# EAGLE design 11A-10 (EAGLE 6.3)
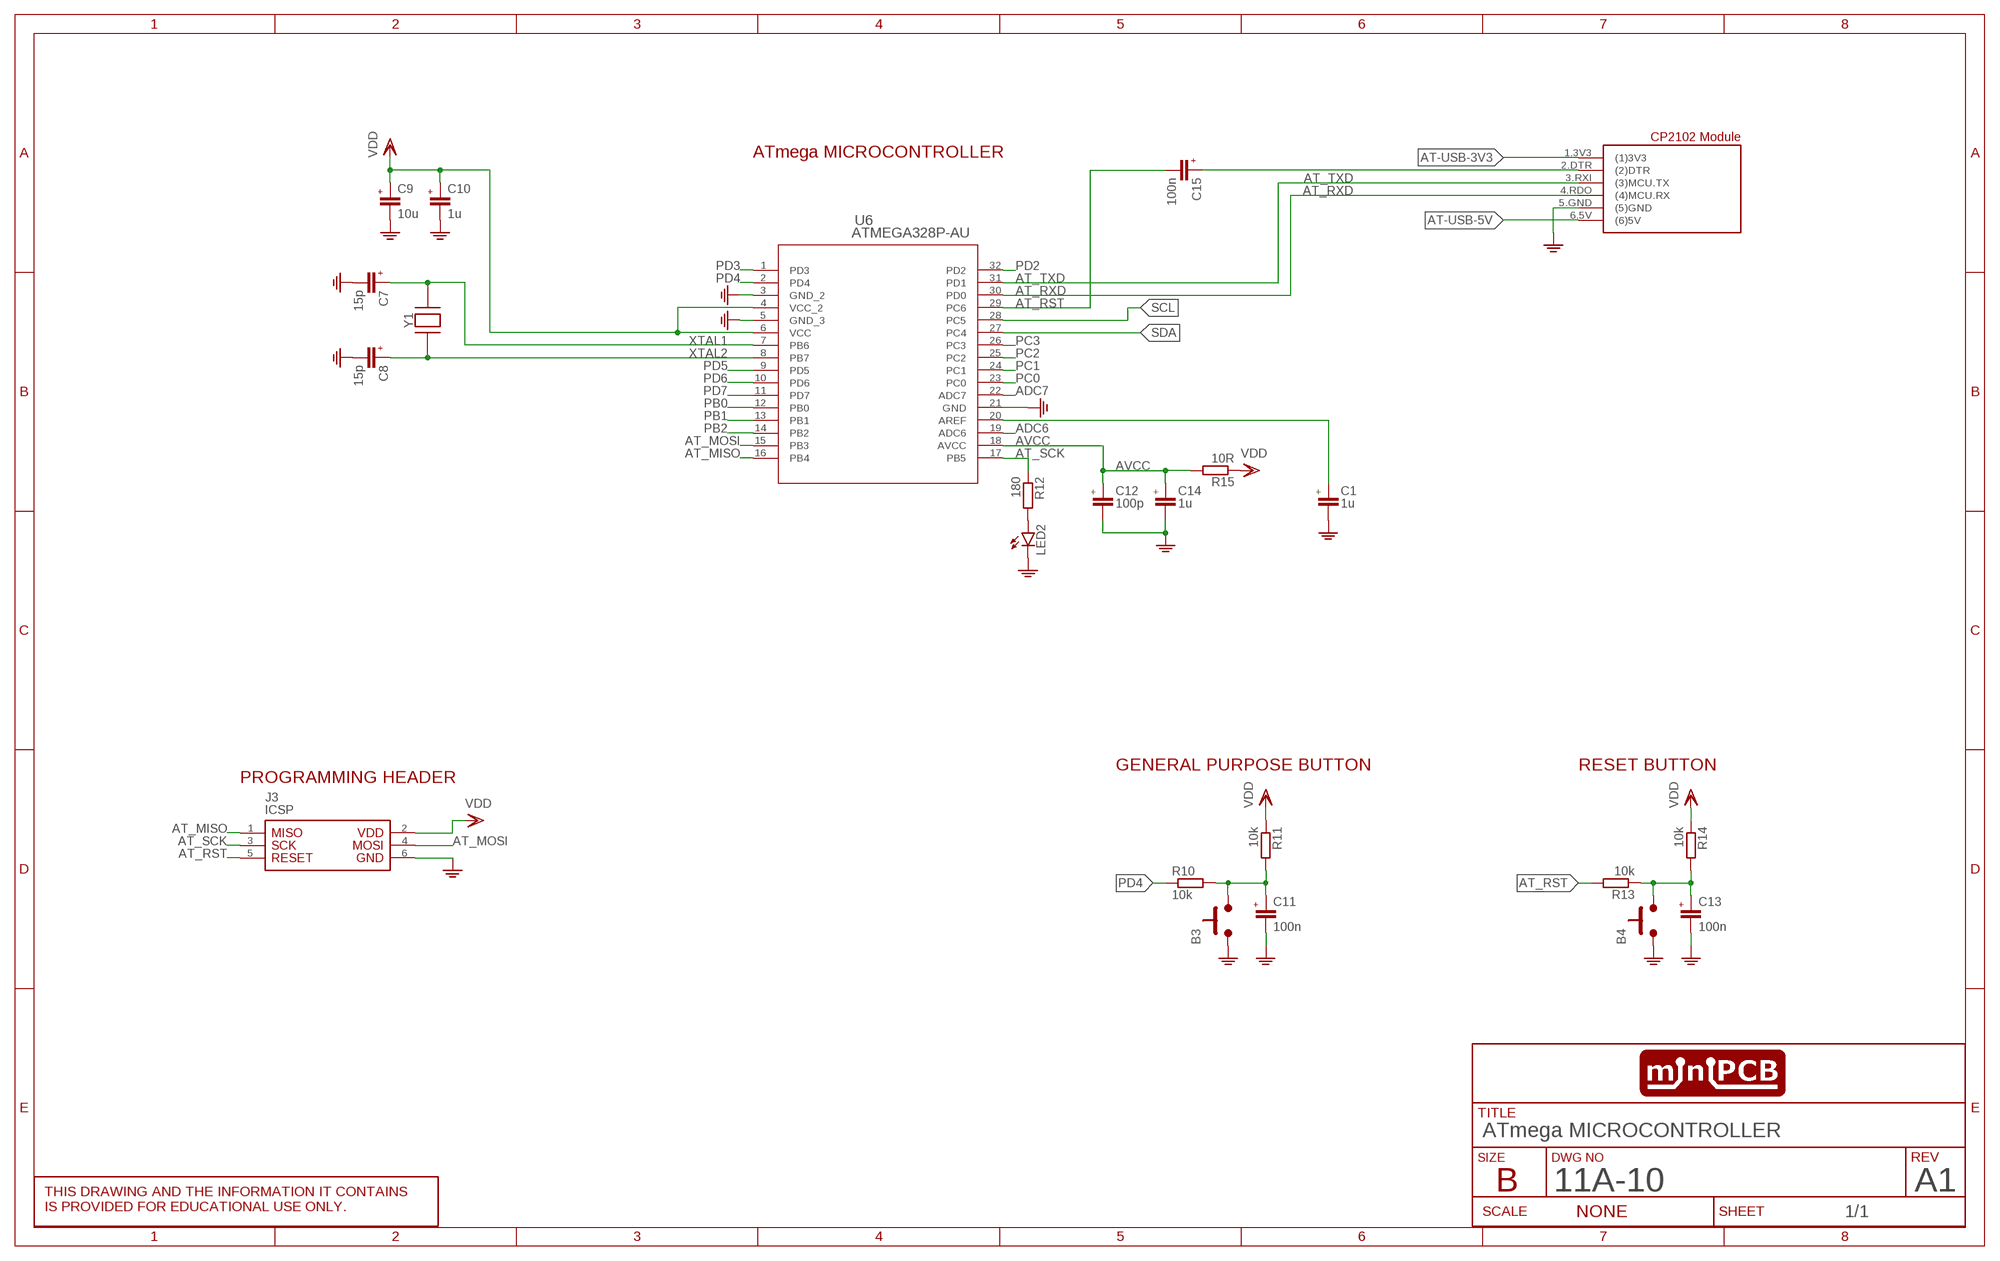
[diagram p0: schematic, sheet 1]
SHEET4 (SCHEMATIC): CIRCUIT_CATEGORY: COMPUTING; CIRCUIT_NAME: MICROCONTROLLER BOARD; CIRCUIT_VARIANT: PIC16F1829, ATmega328P-AU; DR: N. MANTEUFEL; DR_DATE: 31JUL2023; ENG: P. MORTON; ENG_DATE: 31JUL2023; PCB_PCBA: PRINTED CIRCUIT BOARD; REVA: A; REVISION: A1; TITLE: ATmega MICROCONTROLLER

## Parts
B3  PUSHBUTTON6X6MM  [6X6MM]
B4  PUSHBUTTON6X6MM  [6X6MM]
C1  1u  C-EU_C0805  [C0805]
C7  15p  C0603  [C0603]
C8  15p  C0603  [C0603]
C9  10u  C0805  [C0805]
C10  1u  C0805  [C0805]
C11  100n  C0805  [C0805]
C12  100p  C-EU_C0805  [C0805]
C13  100n  C0805  [C0805]
C14  1u  C-EU_C0805  [C0805]
C15  100n  C0805  [C0805]
J3  ICSP  PINS_6-2X3_AT  [PINS_6-2X3_AT]
LED2  LEDSML0805  [SML0805]
R10  10k  R-EU__R0805  [R0805]
R11  10k  R-EU__R0805  [R0805]
R12  180  R-EU__R0805  [R0805]
R13  10k  R-EU__R0805  [R0805]
R14  10k  R-EU__R0805  [R0805]
R15  10R  R-EU__R0805  [R0805]
U6  ATMEGA328P-AU  ATMEGA328-AU  [32A_ATM]
U7  VIVA_USB-TTL  [VIVA_USB_TTL_SUBTEXT]
Y1  CRYSTAL-3225_4P  [TXC7M2]

## Nets
ADC6: U6.19(ADC6)
ADC7: U6.22(ADC7)
AT-USB-3V3: U7.1.3V3((1)3V3)
AT-USB-5V: U7.6.5V((6)5V)
AT_DTR_CAP: C15.1(+) U7.2.DTR((2)DTR)
AT_MISO: J3.1 U6.16(PB4)
AT_MOSI: J3.4 U6.15(PB3)
AT_RST: C15.2(-) J3.5 R13.2 U6.29(PC6)
AT_RST_CAP: B4.3.B B4.4.B C13.1(+) R13.1 R14.2
AT_RXD: U6.30(PD0) U7.4.RDO((4)MCU.RX)
AT_SCK: J3.3 R12.1 U6.17(PB5)
AT_TXD: U6.31(PD1) U7.3.RXI((3)MCU.TX)
AVCC: C12.1 C14.1 R15.2 U6.18(AVCC)
GND: B3.1.A B3.2.A B4.1.A B4.2.A C1.2 C7.1(-) C8.1(-) C9.2(-) C10.2(-) C11.2(-) C12.2 C13.2(-) C14.2 J3.6 LED2.C U6.3(GND_2) U6.5(GND_3) U6.21(GND) U7.5.GND((5)GND)
N$4: C1.1 U6.20(AREF)
N$37: LED2.A R12.2
PB0: U6.12(PB0)
PB1: U6.13(PB1)
PB2: U6.14(PB2)
PC0: U6.23(PC0)
PC1: U6.24(PC1)
PC2: U6.25(PC2)
PC3: U6.26(PC3)
PD2: U6.32(PD2)
PD3: U6.1(PD3)
PD4: R10.1 U6.2(PD4)
PD4-CAP: B3.3.B B3.4.B C11.1(+) R10.2 R11.2
PD5: U6.9(PD5)
PD6: U6.10(PD6)
PD7: U6.11(PD7)
SCL: U6.28(PC5)
SDA: U6.27(PC4)
VDD: C9.1(+) C10.1(+) J3.2 R11.1 R14.1 R15.1 U6.4(VCC_2) U6.6(VCC)
XTAL1: C7.2(+) U6.7(PB6) Y1.3
XTAL2: C8.2(+) U6.8(PB7) Y1.1

## Notes on the sheet
- ATmega MICROCONTROLLER
- GENERAL PURPOSE BUTTON | RESET BUTTON
- PROGRAMMING HEADER

## Library data of the parts
B3 B4 = nolan-utsa:PUSHBUTTON: Tactile push button switch
C1 C12 C14 = utsa:C-EU: CAPACITOR, European symbol
C7-C11 C13 C15 = utsa:C
J3 = utsa:PINS_6-2X3_AT; P1: MISO; P2: VDD; P3: SCK; P4: MOSI; P5: RESET; P6: GND
LED2 = utsa:LED: LED OSRAM: - CHIPLED LG R971, LG N971, LY N971, LG Q971, LY Q971, LO R971, LY R971 LH N974, LH R974 LS Q976, LO Q976, LY Q976 LO Q996 - Hyper CHIPLED LW Q18S LB Q993, LB Q99A, LB R99A - SideLED LS A670, LO A670, LY A670, LG A670, LP A670 LB A673, LV A673, LT A673, LW A673 LH A674 LY A675 LS A676, LA A676, LO A676, LY A676, LW A676 LS A679, LY A679, LG A679 - Hyper Micro SIDELED® LS Y876, LA Y876, LO Y876, LY Y876 LT Y87S - SmartLED LW L88C, LW L88S LB L89C, LB L89S, LG L890 LS L89K, LO L89K, LY L89K LS L896, LA L896, LO L896, LY L896 - TOPLED LS T670, LO T670, LY T670, LG T670, LP T670 LSG T670, LSP T670, LSY T670, LOP T670, LYG T670 LG T671, LOG T671, LSG T671 LB T673, LV T673, LT T673, LW T673 LH T674 LS T676, LA T676, LO T676, LY T676, LB T676, LH T676, LSB T676, LW T676 LB T67C, LV T67C, LT T67C, LS T67K, LO T67K, LY T67K, LW E67C LS E67B, LA E67B, LO E67B, LY E67B, LB E67C, LV E67C, LT E67C LW T67C LS T679, LY T679, LG T679 LS T770, LO T770, LY T770, LG T770, LP T770 LB T773, LV T773, LT T773, LW T773 LH T774 LS E675, LA E675, LY E675, LS T675 LS T776, LA T776, LO T776, LY T776, LB T776 LHGB T686 LT T68C, LB T68C - Hyper Mini TOPLED® LB M676 - Mini TOPLED Santana® LG M470 LS M47K, LO M47K, LY M47K Source: http://www.osram.convergy.de LUXEON: - LUMILED® LXK2-PW12-R00, LXK2-PW12-S00, LXK2-PW14-U00, LXK2-PW14-V00 LXK2-PM12-R00, LXK2-PM12-S00, LXK2-PM14-U00 LXK2-PE12-Q00, LXK2-PE12-R00, LXK2-PE12-S00, LXK2-PE14-T00, LXK2-PE14-U00 LXK2-PB12-K00, LXK2-PB12-L00, LXK2-PB12-M00, LXK2-PB14-N00, LXK2-PB14-P00, LXK2-PB14-Q00 LXK2-PR12-L00, LXK2-PR12-M00, LXK2-PR14-Q00, LXK2-PR14-R00 LXK2-PD12-Q00, LXK2-PD12-R00, LXK2-PD12-S00 LXK2-PH12-R00, LXK2-PH12-S00 LXK2-PL12-P00, LXK2-PL12-Q00, LXK2-PL12-R00 Source: www.luxeon.com KINGBRIGHT: KA-3528ASYC Source: www.kingbright.com
R10-R15 = utsa:R-EU_: RESISTOR, European symbol
U6 = utsa:ATMEGA328-AU; COPYRIGHT: Copyright (C) 2021 Ultra Librarian. All rights reserved.; MANUFACTURER_PART_NUMBER: ATMEGA328-AU; MFR_NAME: Microchip
U7 = utsa:VIVA_USB-TTL
Y1 = utsa:CRYSTAL: HC49S Crystal Oscillator

## Board
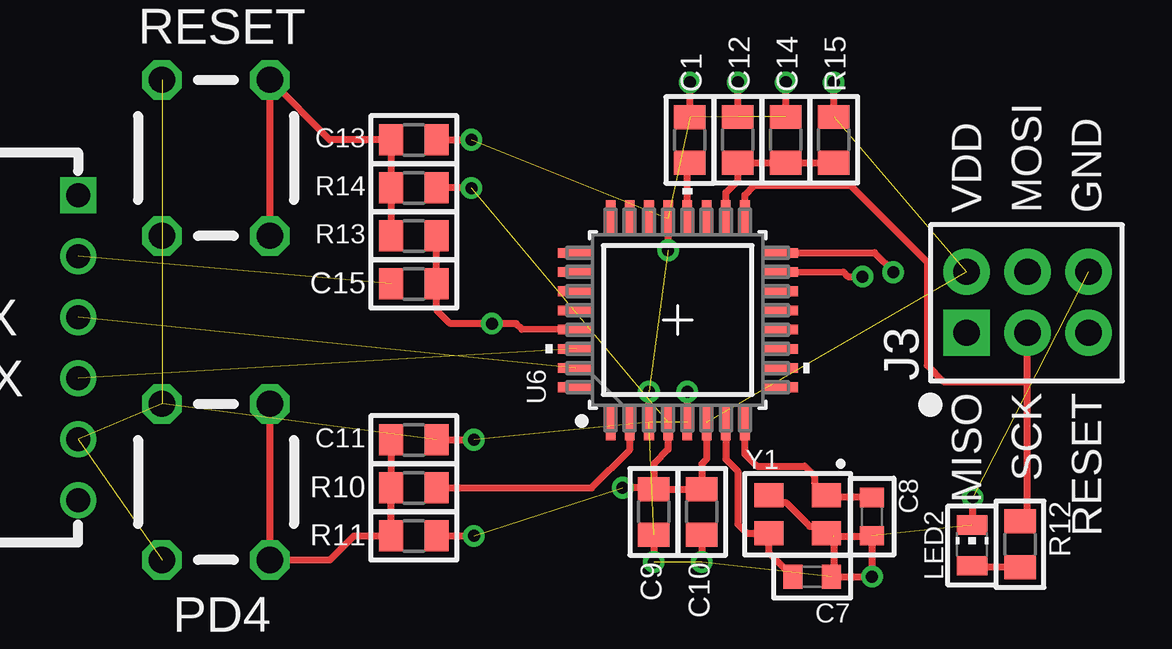
[diagram p1: board, top side]
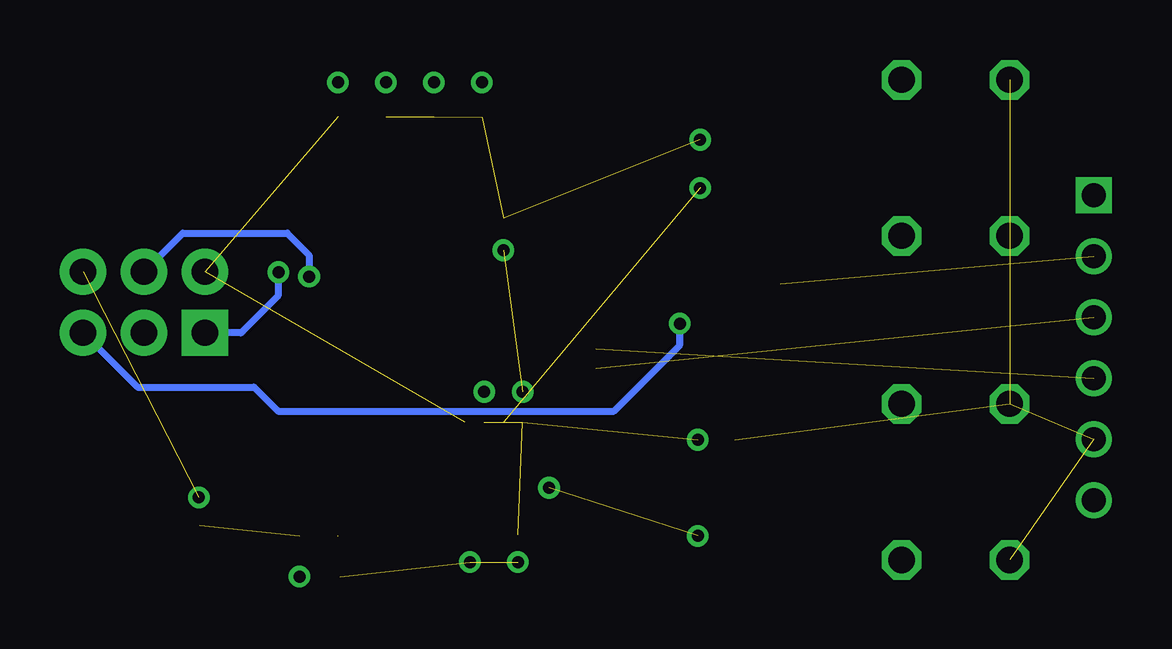
[diagram p2: board, bottom side, seen from below]

No outline drawn. Coordinates in mm, seen from the top.
Copper layers (1+2*15+16): Top 0.035mm / dielectric 0.15mm / Route2 0.035mm / dielectric 0.15mm / Route15 0.035mm / dielectric 0.2mm / Bottom 0.035mm
Design rules "minipcb-SMD-4L": minimum track width 0.25mm, minimum drill 0.5mm, track to track 0.2mm, track to pad 0.2mm, pad to pad 0.15mm, via to via 0.2mm, smd to smd 0.15mm, copper to edge 1mm, drill to drill 1mm, minimum pad ring 0.2mm, minimum via ring 0.2mm, stop-mask expansion 0.1mm, vias tented up to drill 0.55mm, thermal gap 0.2mm

### Footprints (pad centres in the part's own frame; a part is rotated, then mirrored left to right if it is on the bottom)
6X6MM = drill 1.1 octagon: 1.A 0,0; 2.A 6.5,0; 3.B 0,4.5; 4.B 6.5,4.5
C0805 = smd 1 x 1.3: 1 -0.95,0; 2 0.95,0
C0603 = smd 0.8 x 1: 1 -0.8,0; 2 0.8,0
PINS_6-2X3_AT = drill 1.1 pad 1.93 square: 1 0,0 | drill 1.1 pad 1.93: 2 2.54,0; 3 0,-2.54; 4 2.54,-2.54; 5 0,-5.08; 6 2.54,-5.08
SML0805 = smd 0.8 x 1.27: A -0.9,0; C 0.8,0
R0805 = smd 1 x 1.3: 1 -0.95,0; 2 0.95,0
32A_ATM = smd 1.5 x 0.4: 1 -4.25,2.8; 2 -4.25,2; 3 -4.25,1.2; 4 -4.25,0.4; 5 -4.25,-0.4; 6 -4.25,-1.2; 7 -4.25,-2; 8 -4.25,-2.8; 17 4.25,-2.8; 18 4.25,-2; 19 4.25,-1.2; 20 4.25,-0.4; 21 4.25,0.4; 22 4.25,1.2; 23 4.25,2; 24 4.25,2.8 | smd 0.4 x 1.5: 9 -2.8,-4.25; 10 -2,-4.25; 11 -1.2,-4.25; 12 -0.4,-4.25; 13 0.4,-4.25; 14 1.2,-4.25; 15 2,-4.25; 16 2.8,-4.25; 25 2.8,4.25; 26 2,4.25; 27 1.2,4.25; 28 0.4,4.25; 29 -0.4,4.25; 30 -1.2,4.25; 31 -2,4.25; 32 -2.8,4.25
VIVA_USB_TTL_SUBTEXT = drill 1 square: 1.3V3 0,0 | drill 1: 2.DTR 0,-2.54; 3.RXI 0,-5.08; 4.RDO 0,-7.62; 5.GND 0,-10.16; 6.5V 0,-12.7
TXC7M2 = smd 1.2 x 1: 1 -1.2,-0.8; 2 1.2,-0.8; 3 1.2,0.8; 4 -1.2,0.8

### Placement (x,y rotation side)
B3  -21.5,-3.49 270 top
B4  -21.5,10.01 270 top
C1  0.5,7.5 90 top
C7  5.6,-10.69 180 top
C8  8.1,-8.19 90 top
C9  -1,-7.99 270 top
C10  1,-7.99 270 top
C11  -11,-4.99 0 top
C12  2.5,7.51 90 top
C13  -11,7.51 0 top
C14  4.5,7.51 90 top
C15  -11,1.51 0 top
J3  12.04,-0.53 90 top
LED2  12.27,-9.34 90 top
R10  -11,-6.99 180 top
R11  -11,-8.99 180 top
R12  14.27,-9.34 270 top
R13  -11,3.51 0 top
R14  -11,5.51 180 top
R15  6.5,7.51 270 top
U6  0,0 90 top
U7  -25,5.2 0 top
Y1  5,-8.09 180 top

### Tracks (layer width: path | path; a pad name or v marks a point on that pad's centre or on a via)
AT_DTR_CAP  (1 unrouted)
AT_MISO  (via drill 0.5 pad 0.9)
  Top 0.3: U6.16 8.2,2.81 9,2.01 v8.98,1.99
  Bottom 0.3: v8.98,1.99 9,1.97 9,1.01 10.54,-0.53 J3.1
AT_MOSI  (via drill 0.5 pad 0.9)
  Top 0.3: U6.15 6.9,2.01 7.1,1.81 v7.7,1.81
  Bottom 0.3: J3.4 12.96,3.62 8.62,3.62 7.7,2.71 v7.7,1.81
AT_RST  (via drill 0.5 pad 0.9)
  Top 0.3: R13.2 C15.2 -10.05,0.41 -9.49,-0.15 v-7.75,-0.15 -6.74,-0.15 -6.5,-0.39 U6.29
  Bottom 0.3: J3.5 14.85,-2.8 10,-2.8 9,-3.8 -5,-3.8 -7.75,-1.05 v-7.75,-0.15
AT_RST_CAP
  Top 0.3: C13.1 -13,7.51 -14.5,7.51 B4.3.B B4.4.B | C13.1 R13.1 | C13.1 R14.2
AT_RXD  (1 unrouted)
AT_SCK
  Top 0.3: U6.17 2.8,5.21 3.2,5.61 7.2,5.61 10.4,2.41 10.4,-1.89 11.08,-2.57 14.62,-2.57 14.58,-2.61 | R12.1 14.58,-8.39 14.58,-2.61 | 14.58,-2.61 J3.3
AT_TXD  (1 unrouted)
AVCC
  Top 0.3: U6.18 2,5.31 2.5,5.81 C12.1 C14.1 R15.2
GND  (via drill 0.5 pad 0.9)  (17 unrouted)
  Top 0.3: U6.5 v0.4,-2.99 | U6.3 v-1.2,-2.99 | U6.21 v-0.4,2.91 | C9.2 v-1,-10.09 | C10.2 v1,-10.09 | C7.1 v8.1,-10.69 C8.1 | LED2.C 12.3,-8.51 v12.3,-7.39 | C1.2 v0.5,9.9 | C12.2 v2.5,9.9 | C14.2 v4.5,9.9 | C13.2 v-8.6,7.51 | C11.2 v-8.5,-4.99
N$1
  Top 0.3: 4.2,-7.6 4.5,-7.6 5.5,-8.6 5.8,-8.6
N$4
  Top 0.3: U6.20 0.4,6.45 arc-90 C1.1
N$15  (1 unrouted)
  Top 0.3: 6.5,-8.99 6.5,-10.49 | 6.49,-9 7.99,-9
N$37
  Top 0.3: R12.2 12.32,-10.29 LED2.A
PD4
  Top 0.3: R10.1 -3.59,-6.99 -2,-5.4 U6.2
PD4-CAP
  Top 0.3: B3.3.B B3.4.B -14.5,-9.99 -13.5,-8.99 R11.2 R10.2 C11.1
VDD  (via drill 0.5, 0.5 pad 0.9)  (5 unrouted)
  Top 0.3: C9.1 C10.1 1,-5.99 1.2,-5.79 U6.6 | U6.4 -0.4,-5.39 -1,-5.99 C9.1 | R11.1 v-8.5,-8.99 | v-8.61,5.51 R14.1 | C9.1 -1.05,-6.99 v-2.3,-6.99 | R15.1 v6.5,9.9
XTAL1
  Top 0.3: C7.2 3.8,-9.69 Y1.3 2.89,-8.89 2.5,-8.5 2.5,-6.3 2,-5.8 U6.7
XTAL2
  Top 0.3: Y1.1 5.7,-6.79 5.7,-6.49 5.3,-6.09 3.3,-6.09 2.8,-5.59 U6.8 | 6.3,-7.19 Y1.1 | C8.2 6.3,-7.39 Y1.1

### Text on the board
tPlace: RESET | PD4